# EAGLE design pocket_scope_complete_adc_v0001 (EAGLE 6.4)
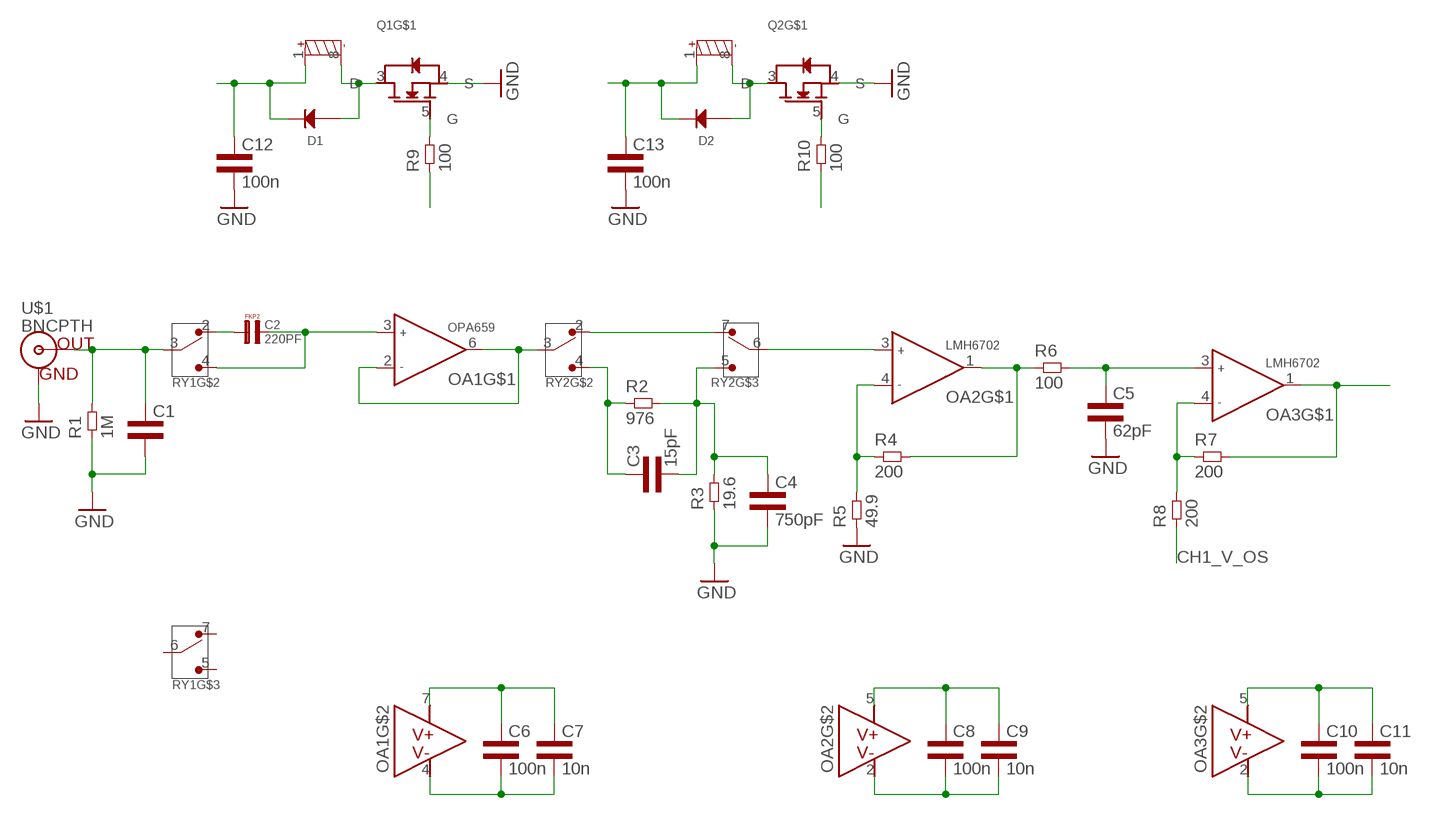
[diagram p0: schematic, sheet 1]

## Parts
C1  CAP0603L3  [0603L3]
C2  220PF  [R5B4K5]
C3  15pF  CAP0603L3  [0603L3]
C4  750pF  CAP0603L3  [0603L3]
C5  62pF  CAP0603L3  [0603L3]
C6  100n  CAP0603L3  [0603L3]
C7  10n  CAP0603L3  [0603L3]
C8  100n  CAP0603L3  [0603L3]
C9  10n  CAP0603L3  [0603L3]
C10  100n  CAP0603L3  [0603L3]
C11  10n  CAP0603L3  [0603L3]
C12  100n  CAP0603L3  [0603L3]
C13  100n  CAP0603L3  [0603L3]
D1  DIODESMA  [SMA-2]
D2  DIODESMA  [SMA-2]
OA1  OPA659  OPA659DRB  [S-PVSON-N8]
OA2  LMH6702  OPA659DBV  [R-PDSO-G5]
OA3  LMH6702  OPA659DBV  [R-PDSO-G5]
Q1  2N7002DWA  [SC70]
Q2  2N7002DWA  [SC70]
R1  1M  RES0603L3  [0603L3]
R2  976  RES0603L3  [0603L3]
R3  19.6  RES0603L3  [0603L3]
R4  200  RES0603L3  [0603L3]
R5  49.9  RES0603L3  [0603L3]
R6  100  RES0603L3  [0603L3]
R7  200  RES0603L3  [0603L3]
R8  200  RES0603L3  [0603L3]
R9  100  RES0603L3  [0603L3]
R10  100  RES0603L3  [0603L3]
RY1  RELAY_SMD  [G6J-2FL-Y]
RY2  RELAY_SMD  [G6J-2FL-Y]
U$1  BNCPTH  [BNC]

## Nets
1_TO_1: RY2.2(T1) RY2.7(T1)
10_TO_1_IN: C3.P$1 R2.P$1 RY2.4(T2)
10_TO_1_OUT: C3.P$2 C4.P$1 R2.P$2 R3.P$2 RY2.5(T2)
AN_CH1: OA3.1(OUTA) R7.P$2
CH1_IN: C1.P$1 R1.P$2 RY1.3(D) U$1.S(OUT)
CH1_V_OS: R8.P$1
GND: C1.P$2 C4.P$2 C5.P$2 C12.P$2 C13.P$2 Q1.4(S) Q2.4(S) R1.P$1 R3.P$1 R5.P$1 U$1.GND
N$1: D1.1(ANODE) Q1.3(D) RY1.8(COIL_-)
N$2: C13.P$1 D2.2(CATHODE) RY2.1(COIL_+)
N$3: C2.1 RY1.2(T1)
N$4: Q1.5(G) R9.P$2
N$5: R9.P$1
N$6: D2.1(ANODE) Q2.3(D) RY2.8(COIL_-)
N$8: Q2.5(G) R10.P$2
N$9: R10.P$1
N$10: C12.P$1 D1.2(CATHODE) RY1.1(COIL_+)
N$11: OA2.3(INA+) RY2.6(D)
N$12: OA2.1(OUTA) R4.P$2 R6.P$1
N$15: C6.P$1 C7.P$1 OA1.7(V+)
N$16: C6.P$2 C7.P$2 OA1.4(V-)
N$17: C8.P$2 C9.P$2 OA2.2(V-)
N$18: C8.P$1 C9.P$1 OA2.5(V+)
N$19: C10.P$1 C11.P$1 OA3.5(V+)
N$20: C10.P$2 C11.P$2 OA3.2(V-)
OA1_IN: C2.2 OA1.3(INA+) RY1.4(T2)
OA1_OUT: OA1.2(INA-) OA1.6(OUTA) RY2.3(D)
OA2_FB: OA2.4(INA-) R4.P$1 R5.P$2
OA3_FB: OA3.4(INA-) R7.P$1 R8.P$2
OA3_IN: C5.P$1 OA3.3(INA+) R6.P$2
Unconnected: Q1.1(S) Q1.2(G) Q1.6(D) Q2.1(S) Q2.2(G) Q2.6(D) RY1.5(T2) RY1.6(D) RY1.7(T1)

## Library data of the parts
C1 C3-C13 = common:CAP
C2 = Capacitor-Wima-FKP2-100v:220PF
D1 D2 = common:DIODE
OA1-OA3 = common:OPA659
Q1 Q2 = common:2N7002DWA
R1-R10 = common:RES
RY1 RY2 = common:RELAY_SMD
U$1 = SparkFun-Connectors:BNC: BNC Connector, Mouser Part# 5227161

## Board
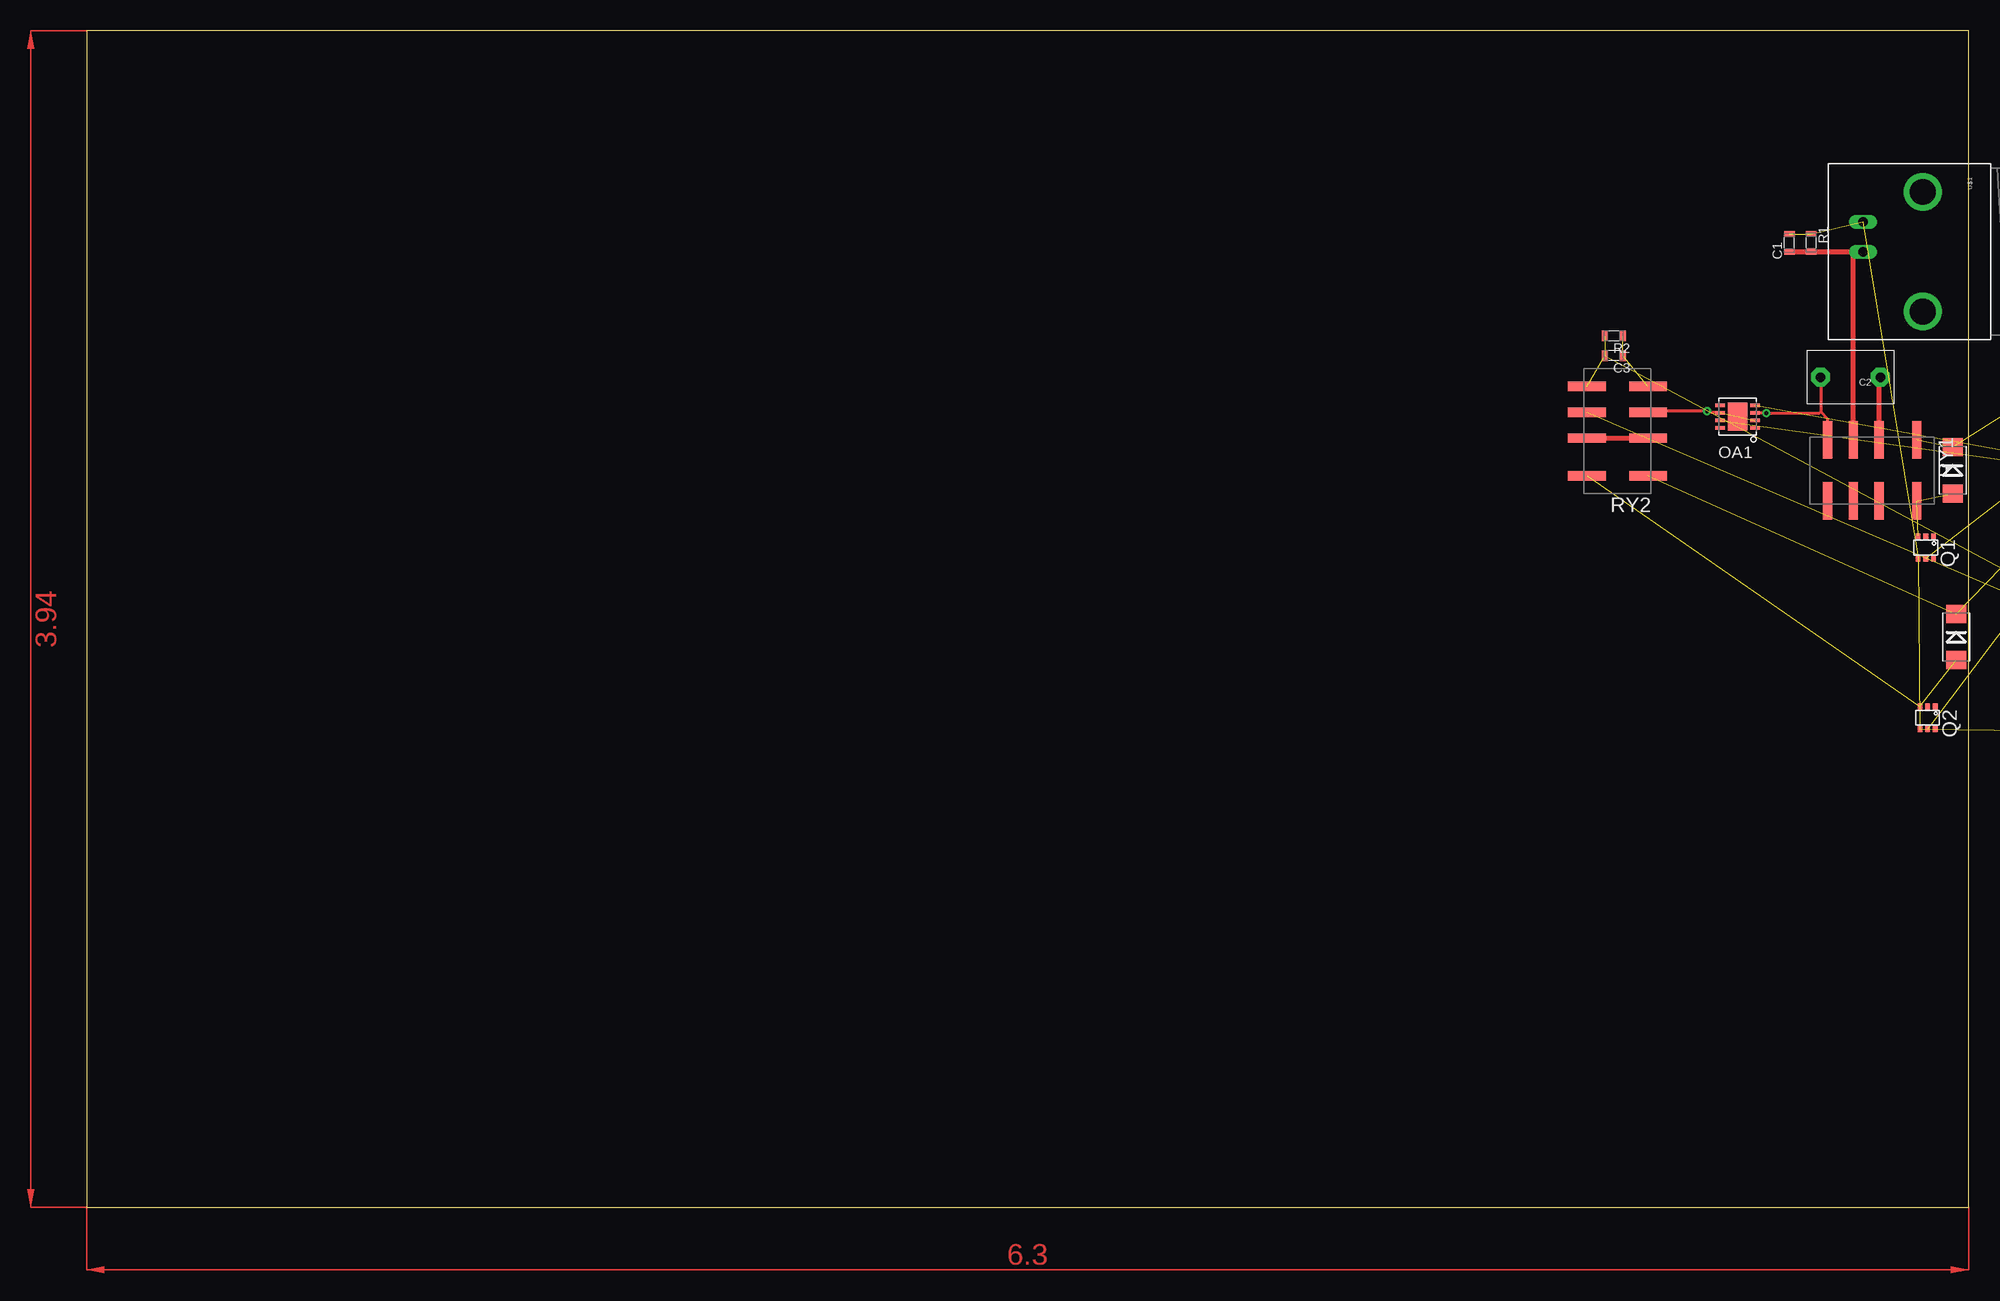
[diagram p1: board, top side]

Size 160 x 100 mm. Coordinates in mm from the lower left corner, seen from the top.
Outline: 0,0 160,0 160,100 0,100 0,0
Copper layers (1*16): Top 0.035mm / dielectric 1.5mm / Bottom 0.035mm
Design rules "osh_2_layer": minimum track width 6mil, minimum drill 13mil, track to track 6mil, track to pad 6mil, pad to pad 6mil, via to via 6mil, smd to smd 0mil, copper to edge 16mil, drill to drill 8mil, minimum pad ring 7mil, minimum via ring 7mil, stop-mask expansion 4mil, vias tented up to drill 16mil, thermal gap 10mil

### Footprints (pad centres in the part's own frame; a part is rotated, then mirrored left to right if it is on the bottom)
0603L3 = smd 0.5 x 0.9: P$1 -0.75,0; P$2 0.75,0
R5B4K5 = drill 0.813 pad 1.6 octagon: 1 -2.54,0; 2 2.54,0
SMA-2 = smd 1.52 x 1.68: 1 -1.965,0; 2 1.965,0
S-PVSON-N8 = smd 0.3 x 0.8: 1 -0.975,-1.475; 2 -0.325,-1.475; 3 0.325,-1.475; 4 0.975,-1.475; 5 0.975,1.475; 6 0.325,1.475; 7 -0.325,1.475; 8 -0.975,1.475 | smd 2.4 x 1.65: P$1 0,0
R-PDSO-G5 = smd 0.55 x 1: 1 -0.95,-1.35; 2 0,-1.35; 3 0.95,-1.35; 4 0.95,1.35; 5 -0.95,1.35
SC70 = smd 0.4 x 0.5: 1 -0.65,-0.95; 2 0,-0.95; 3 0.65,-0.95; 4 0.65,0.95; 5 0,0.95; 6 -0.65,0.95
G6J-2FL-Y = smd 0.8 x 3.2: 1 -3.2,-2.6; 2 0,-2.6; 3 2.2,-2.6; 4 4.4,-2.6; 5 4.4,2.6; 6 2.2,2.6; 7 0,2.6; 8 -3.2,2.6
BNC = drill 2.2: 3 -5.08,5.08; 4 5.08,5.08 | drill 0.8 long: GND -2.54,0; S 0,0

### Placement (x,y rotation side)
C1  144.78,81.99 90 top
C2  149.96,70.56 180 top
C3  129.84,72.39 180 top
C4  188.37,40.23 180 top  (outside the outline)
C5  188.37,53.64 180 top  (outside the outline)
C6  188.37,57.15 180 top  (outside the outline)
C7  188.37,59.89 180 top  (outside the outline)
C8  188.37,62.64 180 top  (outside the outline)
C9  188.37,65.38 180 top  (outside the outline)
C10  188.37,68.12 180 top  (outside the outline)
C11  188.37,70.87 180 top  (outside the outline)
C12  194.31,87.63 180 top  (outside the outline)
C13  200.41,94.03 180 top  (outside the outline)
D1  158.65,62.64 90 top
D2  158.95,48.46 90 top
OA1  140.36,67.21 90 top
OA2  167.34,49.53 180 top  (outside the outline)
OA3  168.1,-1.68 180 top  (outside the outline)
Q1  156.36,56.08 180 top
Q2  156.51,41.61 180 top
R1  146.61,81.99 270 top
R2  129.84,74.07 180 top
R3  188.37,34.75 180 top  (outside the outline)
R4  188.37,44.04 180 top  (outside the outline)
R5  188.37,46.79 180 top  (outside the outline)
R6  188.37,50.6 180 top  (outside the outline)
R7  188.37,74.68 180 top  (outside the outline)
R8  188.37,77.42 180 top  (outside the outline)
R9  194.31,83.82 180 top  (outside the outline)
R10  200.41,97.84 180 top  (outside the outline)
RY1  152.4,62.64 180 top
RY2  130.15,65.38 90 top
U$1  151.03,81.23 270 top

### Tracks (layer width: path | path; a pad name or v marks a point on that pad's centre or on a via)
1_TO_1
  Top 0.406: RY2.7 RY2.2
10_TO_1_IN  (2 unrouted)
10_TO_1_OUT  (4 unrouted)
AN_CH1  (1 unrouted)
CH1_IN
  Top 0.406: RY1.3 150.2,81.14 150.11,81.23 U$1.S 151.02,81.24 R1.P$2 C1.P$1
GND  (10 unrouted)
N$1  (2 unrouted)
N$2  (2 unrouted)
N$3
  Top 0.406: RY1.2 152.4,70.46 C2.1
N$4  (1 unrouted)
N$6  (2 unrouted)
N$8  (1 unrouted)
N$10  (2 unrouted)
N$11  (1 unrouted)
N$12  (2 unrouted)
N$15  (2 unrouted)
N$16  (2 unrouted)
N$17  (2 unrouted)
N$18  (2 unrouted)
N$19  (2 unrouted)
N$20  (2 unrouted)
OA1_IN  (via drill 0.33)
  Top 0.254: 147.42,67.61 147.98,67.06 147.98,65.26 RY1.4 | C2.2 147.42,67.61 | OA1.3 142.47,67.53 142.49,67.51 v142.8,67.51 147.32,67.51 147.42,67.61
OA1_OUT  (via drill 0.33)  (1 unrouted)
  Top 0.254: OA1.6 137.9,67.53 v137.77,67.67 132.84,67.67 RY2.3
OA2_FB  (2 unrouted)
OA3_FB  (2 unrouted)
OA3_IN  (2 unrouted)
(copper drawn outside any net)
  shapes: Top area x2